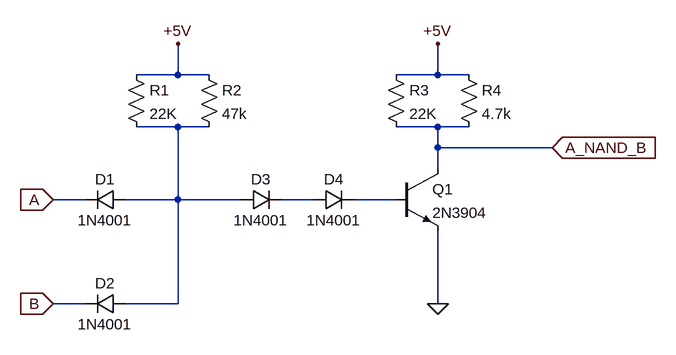
[diagram p0: schematic FullAdder.asc]
FullAdder.asc, the LTspice schematic file:
Version 4
SHEET 1 880 680
WIRE -32 48 -32 0
WIRE -32 48 -96 48
WIRE 16 48 -32 48
WIRE 368 48 368 0
WIRE 368 48 304 48
WIRE 416 48 368 48
WIRE -32 128 -96 128
WIRE 16 128 -32 128
WIRE 368 128 304 128
WIRE 416 128 368 128
WIRE 368 160 368 128
WIRE 544 160 368 160
WIRE 368 192 368 160
WIRE -176 240 -224 240
WIRE -32 240 -32 128
WIRE -32 240 -112 240
WIRE 64 240 -32 240
WIRE 176 240 128 240
WIRE 304 240 240 240
WIRE -176 400 -224 400
WIRE -32 400 -32 240
WIRE -32 400 -112 400
WIRE 368 400 368 288
FLAG -224 400 B
IOPIN -224 400 In
FLAG -224 240 A
IOPIN -224 240 In
FLAG -32 0 +5V
FLAG 368 0 +5V
FLAG 368 400 0
FLAG 544 160 A_NAND_B
IOPIN 544 160 In
SYMBOL diode -112 224 R90
WINDOW 0 0 32 VBottom 2
WINDOW 3 32 32 VTop 2
SYMATTR InstName D1
SYMATTR Value 1N4001
SYMBOL diode -112 384 R90
WINDOW 0 0 32 VBottom 2
WINDOW 3 32 32 VTop 2
SYMATTR InstName D2
SYMATTR Value 1N4001
SYMBOL res -112 32 R0
SYMATTR InstName R1
SYMATTR Value 22K
SYMBOL res 0 32 R0
SYMATTR InstName R2
SYMATTR Value 47k
SYMBOL diode 64 256 R270
WINDOW 0 32 32 VTop 2
WINDOW 3 0 32 VBottom 2
SYMATTR InstName D3
SYMATTR Value 1N4001
SYMBOL diode 176 256 R270
WINDOW 0 32 32 VTop 2
WINDOW 3 0 32 VBottom 2
SYMATTR InstName D4
SYMATTR Value 1N4001
SYMBOL npn 304 192 R0
SYMATTR InstName Q1
SYMATTR Value 2N3904
SYMBOL res 288 32 R0
SYMATTR InstName R3
SYMATTR Value 22K
SYMBOL res 400 32 R0
SYMATTR InstName R4
SYMATTR Value 4.7k

The netlist it stands for:
* FullAdder.asc
D1 N001 A 1N4001
D2 N001 B 1N4001
R1 +5V N001 22K
R2 +5V N001 47k
D3 N001 N002 1N4001
D4 N002 N003 1N4001
Q1 A_NAND_B N003 0 0 2N3904
R3 +5V A_NAND_B 22K
R4 +5V A_NAND_B 4.7k
.model D D
.lib standard.dio
.model NPN NPN
.model PNP PNP
.lib standard.bjt
.backanno
.end